# Altium schematic sheet DisplayPort_Mux.SchDoc: DisplayPort Mux
size 431 x 279 mm; Author: Eric Liu; SheetNumber: 8; SheetTotal: 9
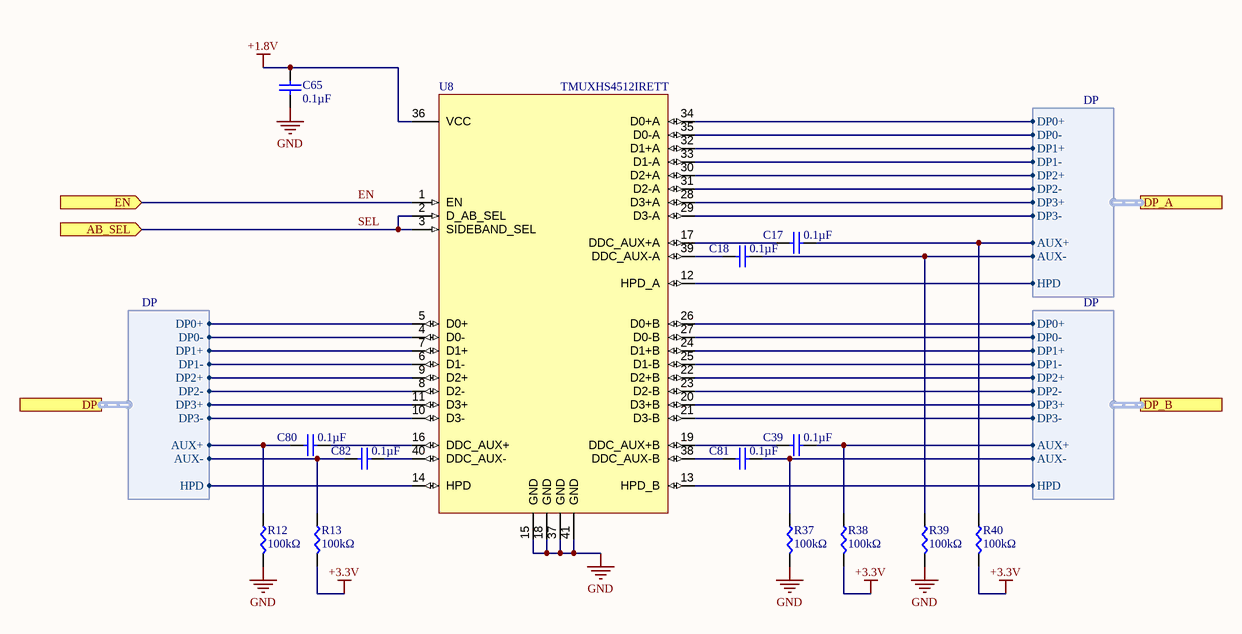
[diagram p0: DisplayPort_Mux.SchDoc]

## Parts
C17  value 0.1µF  [CAP0402]  (hidden comment: CC0402KRX5R9BB104)
C18  value 0.1µF  [CAP0402]  (hidden comment: CC0402KRX5R9BB104)
C39  value 0.1µF  [CAP0402]  (hidden comment: CC0402KRX5R9BB104)
C65  value 0.1µF  [CAP0402]  (hidden comment: CC0402KRX5R9BB104)
C80  value 0.1µF  [CAP0402]  (hidden comment: CC0402KRX5R9BB104)
C81  value 0.1µF  [CAP0402]  (hidden comment: CC0402KRX5R9BB104)
C82  value 0.1µF  [CAP0402]  (hidden comment: CC0402KRX5R9BB104)
R12  value 100kΩ  [RES0402]  (hidden comment: ERJ-2RKF1003X)
R13  value 100kΩ  [RES0402]  (hidden comment: ERJ-2RKF1003X)
R37  value 100kΩ  [RES0402]  (hidden comment: ERJ-2RKF1003X)
R38  value 100kΩ  [RES0402]  (hidden comment: ERJ-2RKF1003X)
R39  value 100kΩ  [RES0402]  (hidden comment: ERJ-2RKF1003X)
R40  value 100kΩ  [RES0402]  (hidden comment: ERJ-2RKF1003X)
U8  TMUXHS4512IRETT

## Ports
AB_SEL (in), DP (harness DP), DP_A (harness DP), DP_B (harness DP), EN (in)

## Harnesses
DP: AUX+, AUX-, DP0+, DP0-, DP1+, DP1-, DP2+, DP2-, DP3+, DP3-, HPD

## Nets
+1.8V: C65.2 U8.36(VCC)
+3.3V: R13.1 R38.1 R40.1
GND: C65.1 R12.1 R37.1 R39.1 U8.15(GND) U8.18(GND) U8.37(GND) U8.41(GND)
EN: U8.1(EN) ; port EN
SEL: U8.2(D_AB_SEL) U8.3(SIDEBAND_SEL) ; port AB_SEL
NetC17_1: C17.1 U8.17(DDC_AUX+A)
NetC17_2: C17.2 R40.2 ; port DP_A.AUX+
NetC18_1: C18.1 U8.39(DDC_AUX-A)
NetC18_2: C18.2 R39.2 ; port DP_A.AUX-
NetC39_1: C39.1 U8.19(DDC_AUX+B)
NetC39_2: C39.2 R38.2 ; port DP_B.AUX+
NetC80_1: C80.1 R12.2 ; port DP.AUX+
NetC80_2: C80.2 U8.16(DDC_AUX+)
NetC81_1: C81.1 U8.38(DDC_AUX-B)
NetC81_2: C81.2 R37.2 ; port DP_B.AUX-
NetC82_1: C82.1 R13.2 ; port DP.AUX-
NetC82_2: C82.2 U8.40(DDC_AUX-)
NetU8_4: U8.4(D0-) ; port DP.DP0-
NetU8_5: U8.5(D0+) ; port DP.DP0+
NetU8_6: U8.6(D1-) ; port DP.DP1-
NetU8_7: U8.7(D1+) ; port DP.DP1+
NetU8_8: U8.8(D2-) ; port DP.DP2-
NetU8_9: U8.9(D2+) ; port DP.DP2+
NetU8_10: U8.10(D3-) ; port DP.DP3-
NetU8_11: U8.11(D3+) ; port DP.DP3+
NetU8_12: U8.12(HPD_A) ; port DP_A.HPD
NetU8_13: U8.13(HPD_B) ; port DP_B.HPD
NetU8_14: U8.14(HPD) ; port DP.HPD
NetU8_20: U8.20(D3+B) ; port DP_B.DP3+
NetU8_21: U8.21(D3-B) ; port DP_B.DP3-
NetU8_22: U8.22(D2+B) ; port DP_B.DP2+
NetU8_23: U8.23(D2-B) ; port DP_B.DP2-
NetU8_24: U8.24(D1+B) ; port DP_B.DP1+
NetU8_25: U8.25(D1-B) ; port DP_B.DP1-
NetU8_26: U8.26(D0+B) ; port DP_B.DP0+
NetU8_27: U8.27(D0-B) ; port DP_B.DP0-
NetU8_28: U8.28(D3+A) ; port DP_A.DP3+
NetU8_29: U8.29(D3-A) ; port DP_A.DP3-
NetU8_30: U8.30(D2+A) ; port DP_A.DP2+
NetU8_31: U8.31(D2-A) ; port DP_A.DP2-
NetU8_32: U8.32(D1+A) ; port DP_A.DP1+
NetU8_33: U8.33(D1-A) ; port DP_A.DP1-
NetU8_34: U8.34(D0+A) ; port DP_A.DP0+
NetU8_35: U8.35(D0-A) ; port DP_A.DP0-

## Notes on the sheet
- DWG. NO.
- REV.
- SHT.
- THIS DOCUMENT AND THE DATA DISCLOSED HEREIN OR HEREWITH IS THE PROPERTY OF ALTIUM LIMITED AND MAY BE FREELY DISTRIBUTED IN WHOLE. NO RIGHTS ARE RESERVED OR EXPRESS OR IMPLIED WARANTEE GIVEN.
- REVISION
- DESCRIPTION
- DATE
- APPROVED
- ENG:
- APPROVALS
- PROJECT
- DSN:
- CHK:
- REFERENCE DOCUMENTS
- PROJECT REVISION:
- TITLE
- DOCUMENT REVISION:
- DESIGN ITEM:
- BOM:
- FAB DWG:
- PCB DWG:
- ASSY DWG:
- SCALE:
- SIZE
- B
- CAGE CODE
- FILE NAME
- DWG NO.
- SHEET
- OF
- REV

## Library data of the parts
C17 C18 C39 C65 C80-C82 = CC0402KRX5R9BB104: 0.1 µF ±10% 50V Ceramic Capacitor X5R 0402 (1005 Metric); Temperature Coefficient: X5R; Package: 0402 (1005 Metric); Voltage: 50V
R12 R13 R37-R40 = ERJ-2RKF1003X: 100 kOhms ±1% 0.1W, 1/10W Chip Resistor 0402 (1005 Metric) Automotive AEC-Q200 Thick Film; Manufacturer 1: Panasonic Electronic Components; Manufacturer Part Number 1: ERJ-2RKF1003X; Supplier Part Number 1: P100KLCT-ND; Supplier 1: Digi-Key; Power Rating: 1/10W
U8 = TMUXHS4512IRETT: 6 Circuit IC Switch 1:2, 2:1 160Ohm 40-WQFN (6x3); Manufacturer: Texas Instruments; Manufacturer Product Number: TMUXHS4512IRETT; Supplier: DigiKey; Supplier Part Number: 296-TMUXHS4512IRETTCT-ND; Datasheet: https://www.ti.com/lit/ds/symlink/tmuxhs4512.pdf?ts=1769995925849&ref_url=https%253A%252F%252Fwww.ti.com%252Fproduct%252FTMUXHS4512; Operating Temperature: -40°C ~ 125°C